# Altium schematic sheet Switch.SchDoc
size A
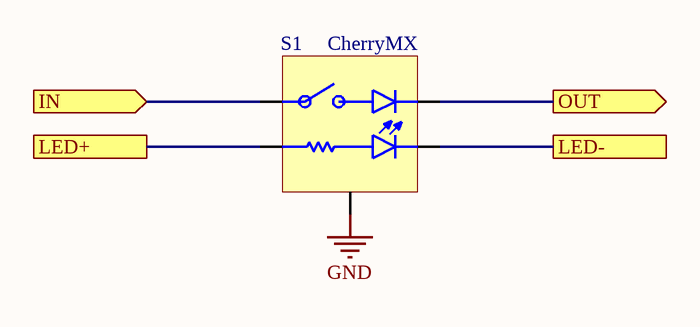
[diagram p0: Switch.SchDoc]

## Parts
S1  CherryMX  [CherryMX_Mirrorable]

## Ports
IN (in), LED+, LED-, OUT (out)

## Nets
GND: S1.1(GND)
IN: S1.2 ; port IN
LED+: S1.4 ; port LED+
LED-: S1.5 ; port LED-
OUT: S1.3 ; port OUT